# Altium schematic sheet ET-power.SchDoc
size A4
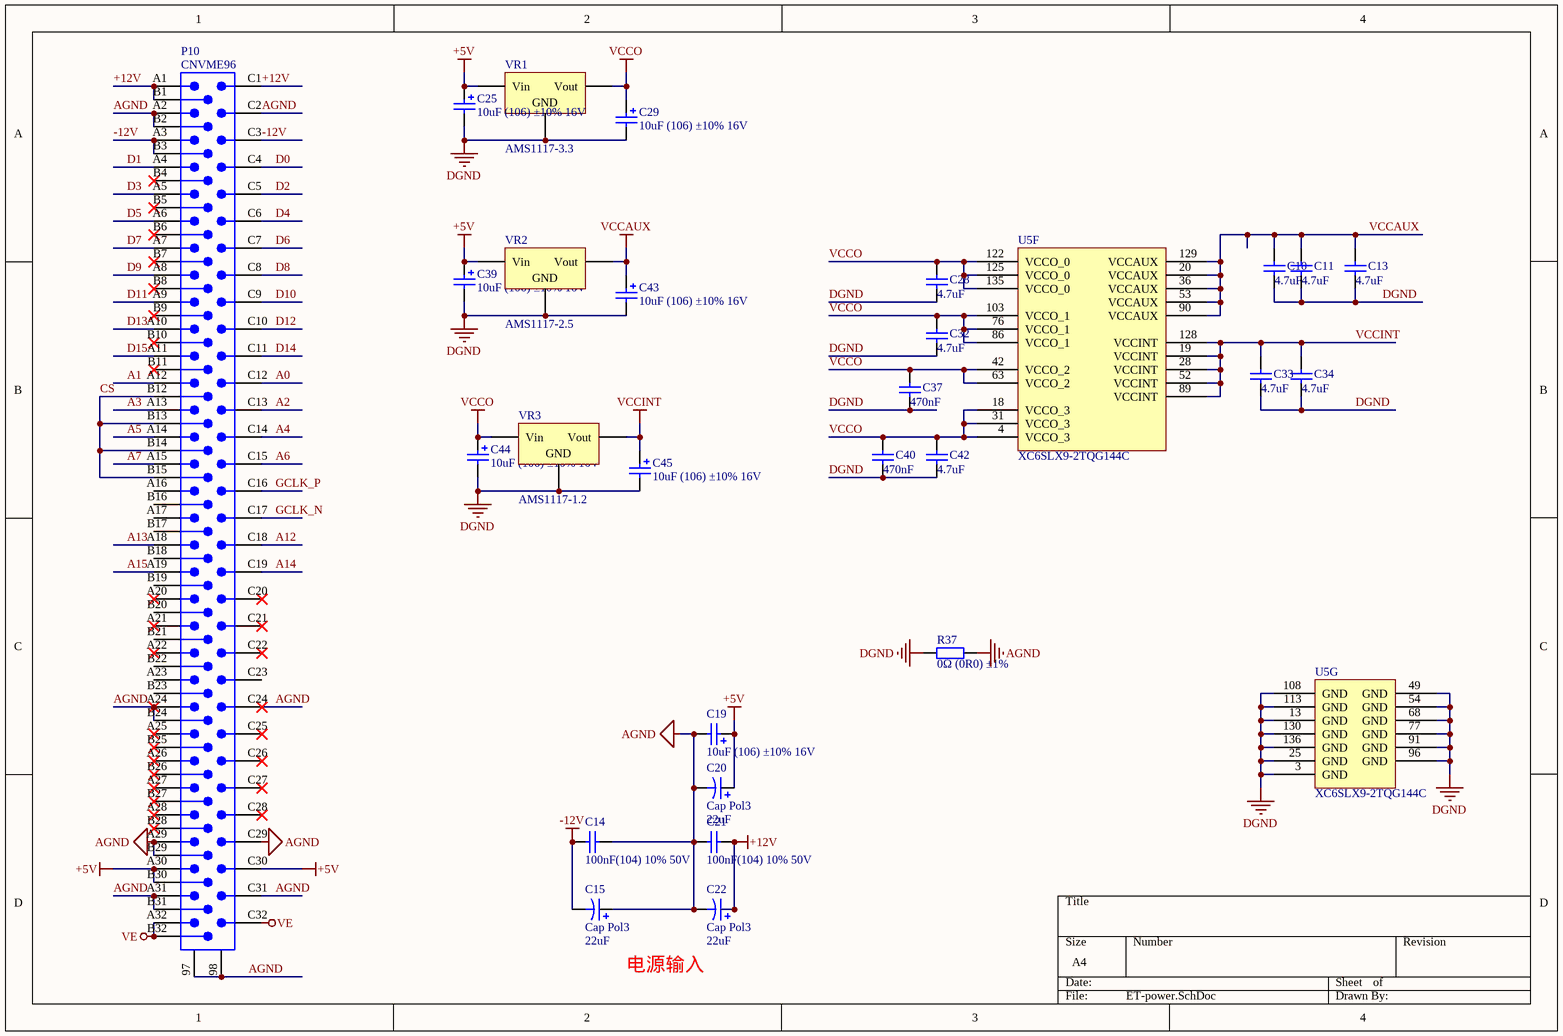
[diagram p0: ET-power.SchDoc]

## Parts
C10  4.7uF  [LC-0805_C]
C11  4.7uF  [LC-0805_C]
C13  4.7uF  [LC-0805_C]
C14  100nF(104) 10% 50V  [LC-0805_C]
C15  Cap Pol3  value 22uF  [C2225]
C19  10uF (106) ±10% 16V  [LC-CASE-A_3216]
C20  Cap Pol3  value 22uF  [C2225]
C21  100nF(104) 10% 50V  [LC-0805_C]
C22  Cap Pol3  value 22uF  [C2225]
C25  10uF (106) ±10% 16V  [LC-CASE-A_3216]
C28  4.7uF  [LC-0805_C]
C29  10uF (106) ±10% 16V  [LC-CASE-A_3216]
C32  4.7uF  [LC-0805_C]
C33  4.7uF  [LC-0805_C]
C34  4.7uF  [LC-0805_C]
C37  470nF  [LC-0805_C]
C39  10uF (106) ±10% 16V  [LC-CASE-A_3216]
C40  470nF  [LC-0805_C]
C42  4.7uF  [LC-0805_C]
C43  10uF (106) ±10% 16V  [LC-CASE-A_3216]
C44  10uF (106) ±10% 16V  [LC-CASE-A_3216]
C45  10uF (106) ±10% 16V  [LC-CASE-A_3216]
P10  CNVME96  [CNVME96]
R37  0Ω (0R0) ±1%  [LC-0805_R]
U5  XC6SLX9-2TQG144C  [TQG144_N]  (parts F,G of 7)
VR1  AMS1117-3.3  [LC-SOT-223]
VR2  AMS1117-2.5  [LC-SOT-223]
VR3  AMS1117-1.2  [LC-SOT-223]

## Nets
+5V: C19.1 C20.1 C25.1 C39.1 P10.A30 P10.B30 P10.C30 VR1.3(Vin) VR2.3(Vin)
+12V: C21.2 C22.1 P10.A1 P10.B1 P10.C1
-12V: C14.1 C15.2 P10.A3 P10.B3 P10.C3
AGND: C14.2 C15.1 C19.2 C20.2 C21.1 C22.2 P10.97 P10.98 P10.A2 P10.A24 P10.A29 P10.A31 P10.B2 P10.B24 P10.B29 P10.B31 P10.C2 P10.C24 P10.C29 P10.C31 R37.2
DGND: C10.1 C11.1 C13.1 C25.2 C28.1 C29.2 C32.1 C33.1 C34.1 C37.1 C39.2 C40.1 C42.1 C43.2 C44.2 C45.2 R37.1 U5.3(GND) U5.13(GND) U5.25(GND) U5.49(GND) U5.54(GND) U5.68(GND) U5.77(GND) U5.91(GND) U5.96(GND) U5.108(GND) U5.113(GND) U5.130(GND) U5.136(GND) VR1.1(GND) VR2.1(GND) VR3.1(GND)
VCCAUX: C10.2 C11.2 C13.2 C43.1 U5.20(VCCAUX) U5.36(VCCAUX) U5.53(VCCAUX) U5.90(VCCAUX) U5.129(VCCAUX) VR2.2(Vout)
VCCINT: C33.2 C34.2 C45.1 U5.19(VCCINT) U5.28(VCCINT) U5.52(VCCINT) U5.89(VCCINT) U5.128(VCCINT) VR3.2(Vout)
VCCO: C28.2 C29.1 C32.2 C37.2 C40.2 C42.2 C44.1 U5.4(VCCO_3) U5.18(VCCO_3) U5.31(VCCO_3) U5.42(VCCO_2) U5.63(VCCO_2) U5.76(VCCO_1) U5.86(VCCO_1) U5.103(VCCO_1) U5.122(VCCO_0) U5.125(VCCO_0) U5.135(VCCO_0) VR1.2(Vout) VR3.3(Vin)
VE: P10.A32 P10.B32 P10.C32
A0: P10.C12
A1: P10.A12
A2: P10.C13
A3: P10.A13
A4: P10.C14
A5: P10.A14
A6: P10.C15
A7: P10.A15
A12: P10.C18
A13: P10.A18
A14: P10.C19
A15: P10.A19
CS: P10.B12 P10.B13 P10.B14 P10.B15
D0: P10.C4
D1: P10.A4
D2: P10.C5
D3: P10.A5
D4: P10.C6
D5: P10.A6
D6: P10.C7
D7: P10.A7
D8: P10.C8
D9: P10.A8
D10: P10.C9
D11: P10.A9
D12: P10.C10
D13: P10.A10
D14: P10.C11
D15: P10.A11
GCLK_N: P10.C17
GCLK_P: P10.C16

Not connected (* = marked no-connect by the designer): P10 A16 A17 A20* A21* A22* A23 A25* A26* A27* A28* B4* B5* B6* B7* B8* B9* B10* B11* B16 B17 B18 B19 B20 B21 B22 B23 B25* B26* B27* B28* C20* C21* C22* C23 C25* C26* C27* C28*

## Notes on the sheet
- 电源输入

## Library data of the parts
C10 C11 C13 C28 C32-C34 C42 = 0805 4.7uF (475) 10% 25V: 贴片电容; ComponentLink1Description: 供应商链接; ComponentLink1URL: http://www.szlcsc.com/product/details_2131.html; Package: 0805; Supplier: LC; SuppliersPartNumber: C1779
C14 C21 = 0805 100nF(104) 10% 50V: 贴片电容; ComponentLink1Description: 供应商链接; ComponentLink1URL: http://www.szlcsc.com/product/details_50686.html; Package: 0805; Supplier: LC; SuppliersPartNumber: C49678
C15 C20 C22 = Cap Pol3: Polarized Capacitor (Surface Mount); Published: 8-Jun-2000; LatestRevisionDate: 29-May-2009; LatestRevisionNote: IPC-7351 Footprint Added.; PackageReference: C0805; Publisher: Altium Limited; PackageDescription: Chip Capacitor
C19 C25 C29 C39 C43-C45 = 3216 10uF (106) 10% 16V: 钽电容; ComponentLink1Description: 供应商链接; ComponentLink1URL: http://www.szlcsc.com/product/details_7643.html; Package: 3216; Supplier: LC; SuppliersPartNumber: C7171
C37 C40 = 0805 470nF (474) 10% 50V: 贴片电容; ComponentLink1Description: 供应商链接; ComponentLink1URL: http://www.szlcsc.com/product/details_14623.html; Package: 0805; Supplier: LC; SuppliersPartNumber: C13967
P10 = CNVME96: 96-Pin Connector (3x32 2.54mm grid); Text Field6: Alternate Layout Available; Text Field7: Published 14-Feb-2002
R37 = 0805 0Ω (0R0) 1%: 贴片电阻; ComponentLink1Description: 供应商链接; ComponentLink1URL: http://www.szlcsc.com/product/details_18165.html; Package: 0805; Supplier: LC; SuppliersPartNumber: C17477
U5 = XC6SLX9-2TQG144C: Spartan-6 LX 1.2V FPGA, 102 User I/Os, 144-Pin TQFP (0.5mm Pitch), Speed Grade 2, Commercial Grade, Pb-Free; Published: 17-Nov-2009; DatasheetVersion: ver1.6, Nov-2010; PackageVersion: ver1.2, Jun-2004; PackageReference: TQG144; Publisher: Altium Limited; PackageDescription: 144-Pin Thin Quad Flat Pack (TQG144) - Pb-Free; Supplier 1: Digi-Key; Supplier Part Number 1: XC6SLX9-2TQG144C-ND; Code_JEDEC: MS-026-BFB; ComponentLink1Description: Manufacturer Link; ComponentLink1URL: http://www.xilinx.com; ComponentLink2Description: Spartan-6 Datasheet; ComponentLink2URL: http://www.xilinx.com/support/documentation/data_sheets/ds160.pdf; ComponentLink3Description: Spartan-6 Documents; ComponentLink3URL: http://www.xilinx.com/support/documentation/spartan-6.htm; ComponentLink4Description: Xilinx.com Home; ComponentLink4URL: http://www.xilinx.com
VR1 = SOT-223 AMS1117-3.3: 低压差线性稳压(LDO); ComponentLink1Description: 供应商链接; ComponentLink1URL: http://www.szlcsc.com/product/details_6652.html; Package: SOT-223; Supplier: LC; SuppliersPartNumber: C6186
VR2 = SOT-223 AMS1117-2.5: 低压差线性稳压(LDO); ComponentLink1Description: 供应商链接; ComponentLink1URL: http://www.szlcsc.com/product/details_6652.html; Package: SOT-223; Supplier: LC; SuppliersPartNumber: C6186
VR3 = SOT-223 AMS1117-1.2: 低压差线性稳压(LDO); ComponentLink1Description: 供应商链接; ComponentLink1URL: http://www.szlcsc.com/product/details_6652.html; Package: SOT-223; Supplier: LC; SuppliersPartNumber: C6186